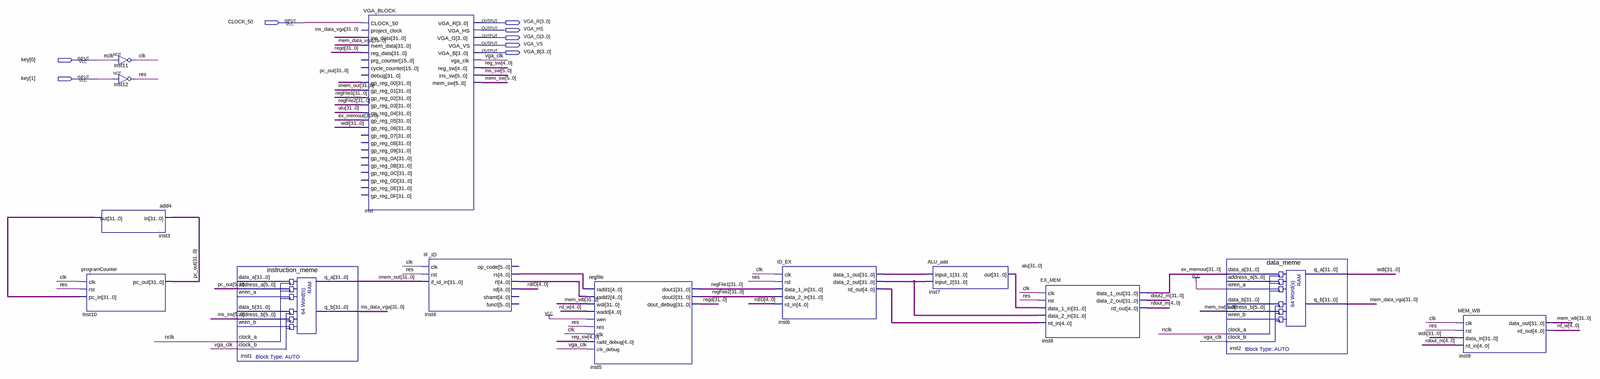
[diagram p0: schematic sheet, whole]
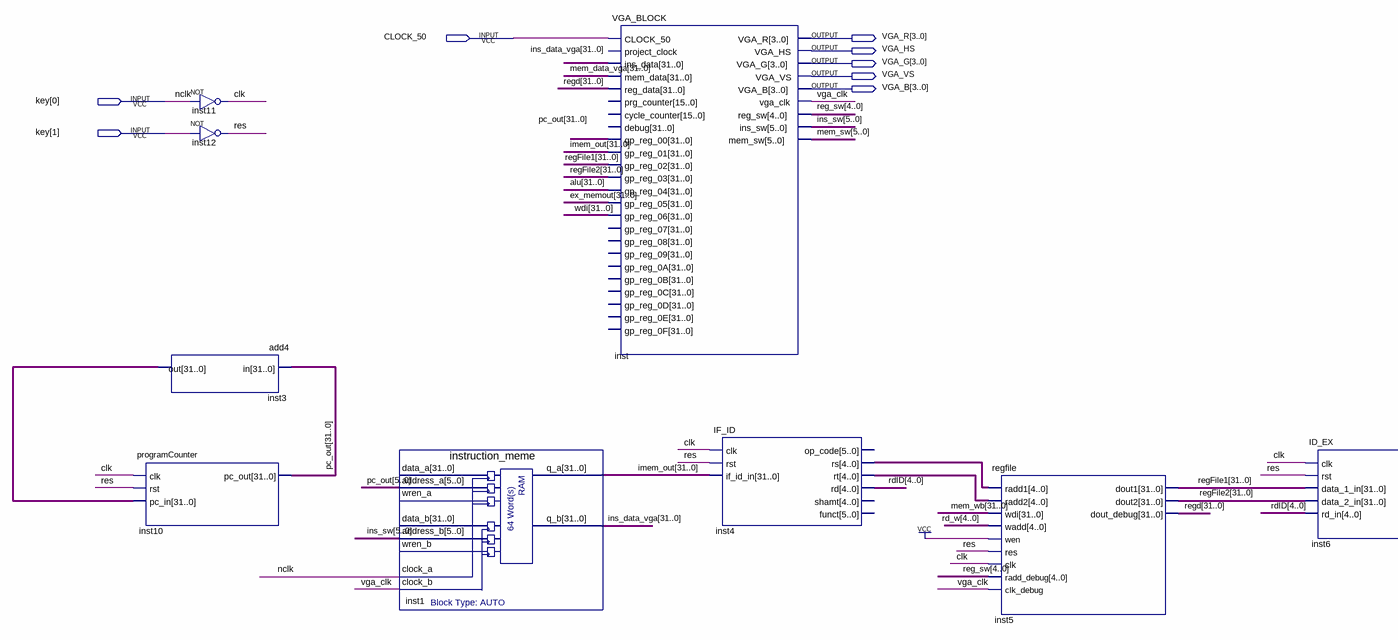
[diagram p1: schematic sheet, left part]
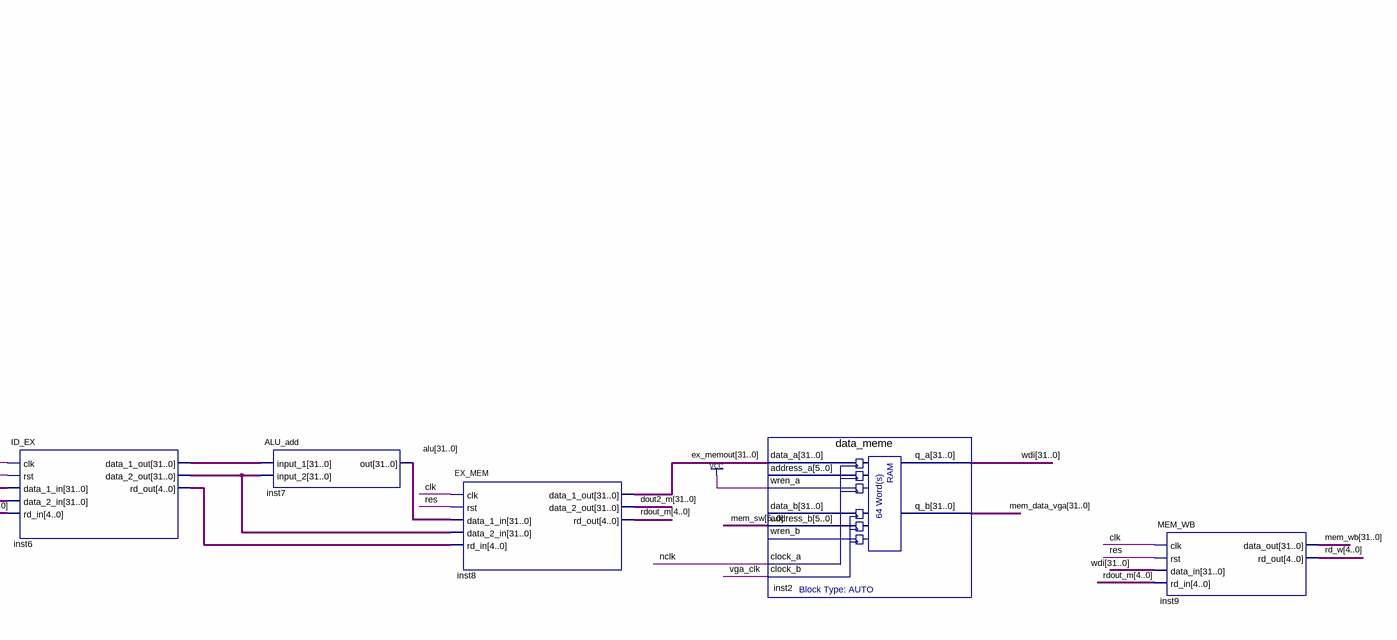
[diagram p2: schematic sheet, right part]
// Quartus schematic Lab_6.bdf as structural Verilog: 13 symbols, 8 pins
module Lab_6 (
  input  CLOCK_50,
  input  [1:0] key,
  output [3:0] VGA_R,
  output VGA_HS,
  output [3:0] VGA_G,
  output VGA_VS,
  output [3:0] VGA_B
);

  wire clk, res, vga_clk;
  wire [4:0] inst4_rs, inst4_rt, inst6_rd_out, rd_w, rdID, rdout_m, reg_sw;
  wire [5:0] ins_sw, mem_sw;
  wire [31:0] alu, dout2_m, ex_memout, imem_out, ins_data_vga, inst3_out, inst6_data_1_out, inst6_data_2_out,
       mem_data_vga, mem_wb, pc_out, regd, regFile1, regFile2, wdi;

  programCounter inst10 (.clk(clk), .rst(res), .pc_in(inst3_out), .pc_out(pc_out));
  not inst11 (clk, key[0]);
  not inst12 (res, key[1]);
  add4 inst3 (.in(pc_out), .out(inst3_out));
  instruction_meme inst1 (
    .address_a(pc_out[5:0]), .address_b(ins_sw), .clock_a(key[0]), .clock_b(vga_clk), .q_a(imem_out),
    .q_b(ins_data_vga));  // open: data_a, wren_a, data_b, wren_b
  VGA_BLOCK inst (
    .CLOCK_50(CLOCK_50), .ins_data(ins_data_vga), .mem_data(mem_data_vga), .reg_data(regd),
    .gp_reg_00(pc_out), .gp_reg_01(imem_out), .gp_reg_02(regFile1), .gp_reg_03(regFile2), .gp_reg_04(alu),
    .gp_reg_05(ex_memout), .gp_reg_06(wdi), .VGA_R(VGA_R), .VGA_HS(VGA_HS), .VGA_G(VGA_G), .VGA_VS(VGA_VS),
    .VGA_B(VGA_B), .vga_clk(vga_clk), .reg_sw(reg_sw), .ins_sw(ins_sw), .mem_sw(mem_sw));  // open: project_clock, prg_counter, cycle_counter, debug, gp_reg_07, gp_reg_08, gp_reg_09, gp_reg_0A, gp_reg_0B, gp_reg_0C, gp_reg_0D, gp_reg_0E, gp_reg_0F
  IF_ID inst4 (
    .clk(clk), .rst(res), .if_id_in(imem_out), .rs(inst4_rs), .rt(inst4_rt), .rd(rdID));  // open: op_code, shamt, funct
  regfile inst5 (
    .radd1(inst4_rs), .radd2(inst4_rt), .wdi(mem_wb), .wadd(rd_w), .wen(1'b1), .res(res), .clk(clk),
    .radd_debug(reg_sw), .clk_debug(vga_clk), .dout1(regFile1), .dout2(regFile2), .dout_debug(regd));
  ID_EX inst6 (
    .clk(clk), .rst(res), .data_1_in(regFile1), .data_2_in(regFile2), .rd_in(rdID),
    .data_1_out(inst6_data_1_out), .data_2_out(inst6_data_2_out), .rd_out(inst6_rd_out));
  ALU_add inst7 (.input_1(inst6_data_1_out), .input_2(inst6_data_2_out), .out(alu));
  EX_MEM inst8 (
    .clk(clk), .rst(res), .data_1_in(alu), .data_2_in(inst6_data_2_out), .rd_in(inst6_rd_out),
    .data_1_out(ex_memout), .data_2_out(dout2_m), .rd_out(rdout_m));
  data_meme inst2 (
    .data_a(ex_memout), .wren_a(1'b1), .address_b(mem_sw), .clock_a(key[0]), .clock_b(vga_clk), .q_a(wdi),
    .q_b(mem_data_vga));  // open: address_a, data_b, wren_b
  MEM_WB inst9 (.clk(clk), .rst(res), .data_in(wdi), .rd_in(rdout_m), .data_out(mem_wb), .rd_out(rd_w));

  // Other names for the same wires on the sheet: nclk = key[0]
endmodule
